# EasyEDA schematic SCH_CyGarageM2.json
TITLE: CyGarage Model 2 (Dual Door); REV: 1.2; Date: 2022-08-23; Sheet: 1/1; Drawn By: Cyrus Brunner; Company: CyrusBuilt
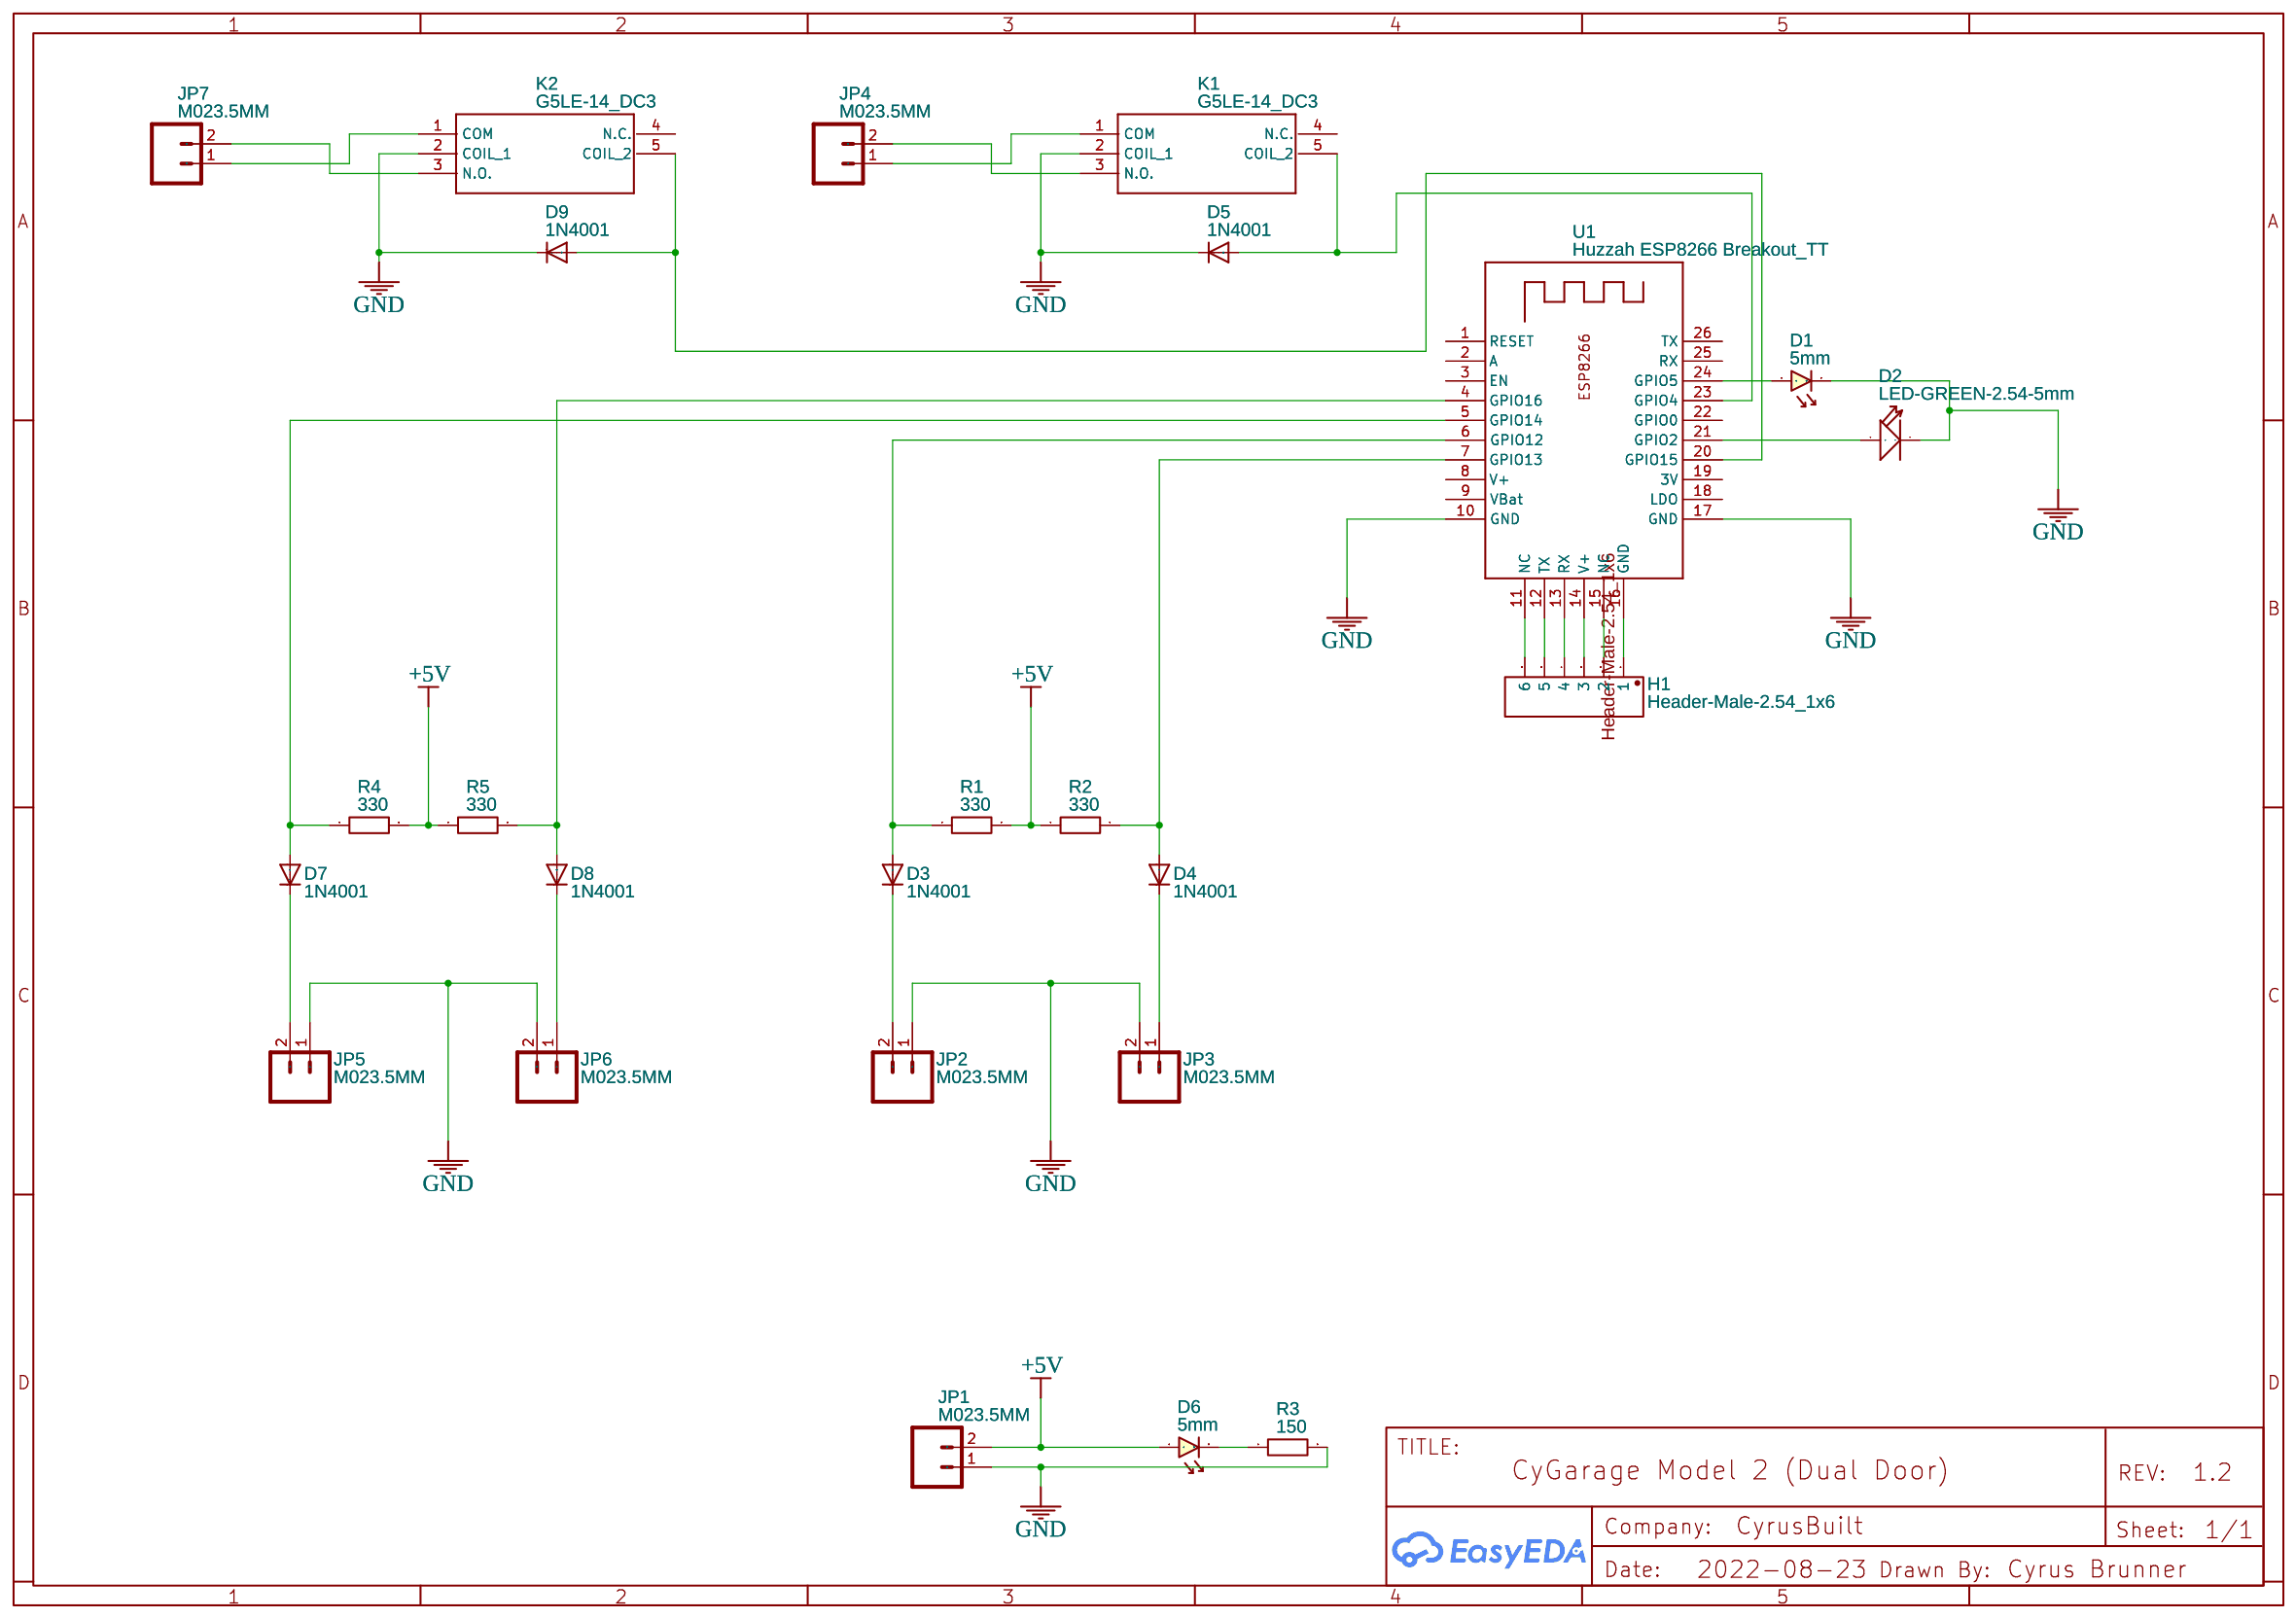
[diagram p0: schematic sheet]

## Parts
D1  5mm  [PKG-LED-5MM-RED]
D2  LED-GREEN-2.54-5mm  [LED-GREEN-2.54-5MM-YUN]
D3  1N4001  [DIODE-1N4001]
D4  1N4001  [DIODE-1N4001]
D5  1N4001  [DIODE-1N4001]
D6  5mm  [PKG-LED-5MM-RED]
D7  1N4001  [DIODE-1N4001]
D8  1N4001  [DIODE-1N4001]
D9  1N4001  [DIODE-1N4001]
H1  Header-Male-2.54_1x6  [HEADER-MALE-2.54_1X6]
JP1  M023.5MM  [SCREWTERMINAL-3.5MM-2]
JP2  M023.5MM  [SCREWTERMINAL-3.5MM-2]
JP3  M023.5MM  [SCREWTERMINAL-3.5MM-2]
JP4  M023.5MM  [SCREWTERMINAL-3.5MM-2]
JP5  M023.5MM  [SCREWTERMINAL-3.5MM-2]
JP6  M023.5MM  [SCREWTERMINAL-3.5MM-2]
JP7  M023.5MM  [SCREWTERMINAL-3.5MM-2]
K1  G5LE-14_DC3  [G5LE-14_SPDT]
K2  G5LE-14_DC3  [G5LE-14_SPDT]
R1  330  [RESISTOR 1/4 WATT 330 OHM]
R2  330  [RESISTOR 1/4 WATT 330 OHM]
R3  150  [RESISTOR 1/4 WATT 150 OHM]
R4  330  [RESISTOR 1/4 WATT 330 OHM]
R5  330  [RESISTOR 1/4 WATT 330 OHM]
U1  Huzzah ESP8266 Breakout_TT  [HUZZAH 8266]

## Library data of the parts
D1 D6 = L-1503EC: Color: Red; WaveLength: 617nm; Forward Voltage: 2.0V; Manufacturer: KINGBRIGHT; Supplier Part: 1003201; Supplier: Element14; link: http://www.farnell.com/datasheets/2046493.pdf?_ga=2.91228057.244688081.1505921947-238689616.1505921947&_gac=1.213042848.1505921947.EAIaIQobChMIsdP1s4y01gIVhxwbCh2_CAopEAAYASAAEgKnhPD_BwE; Contributor: Prof. Ing. F. Scordino
D2 = LED-GREEN-2.54-5mm: DIP LED Transparent-Orange;; Manufacturer Part: 503UOC; Contributor: koreawide
D3-D5 D7-D9 = 1N4001: Contributor: SparkFun
H1 = Header-Male-2.54_1x6: Contributor: RexBoy
JP1-JP7 = M023.5MM: Standard 2-pin 0.1 header. Use with; Contributor: SparkFun
K1 K2 = G5LE-14_DC3: Contributor: Diego Perello
R1 R2 R4 R5 = 330: Contributor: Hendriyana
R3 = 150: Contributor: Hendriyana
U1 = Huzzah ESP8266 Breakout_TT: Manufacturer: Adafruit; link: https://www.adafruit.com/product/2471; Contributor: t_thompson92

## Nets
+5V: D6.1 JP1.2 R1.2 R2.1 R4.2 R5.1
GND: D1.2 D2.- D5.C D9.C JP1.1 JP2.1 JP3.2 JP5.1 JP6.2 K1.2(COIL_1) K2.2(COIL_1) R3.2 U1.10(GND) U1.17(GND)
Net-(D1-1): D1.1 U1.24(GPIO5)
Net-(D2-+): D2.+ U1.21(GPIO2)
Net-(D3-A): D3.A R1.1 U1.6(GPIO12)
Net-(D3-C): D3.C JP2.2
Net-(D4-A): D4.A R2.2 U1.7(GPIO13)
Net-(D4-C): D4.C JP3.1
Net-(D5-A): D5.A K1.5(COIL_2) U1.23(GPIO4)
Net-(D6-2): D6.2 R3.1
Net-(D7-A): D7.A R4.1 U1.5(GPIO14)
Net-(D7-C): D7.C JP5.2
Net-(D8-A): D8.A R5.2 U1.4(GPIO16)
Net-(D8-C): D8.C JP6.1
Net-(D9-A): D9.A K2.5(COIL_2) U1.20(GPIO15)
Net-(H1-1): H1.1 U1.16(GND)
Net-(H1-2): H1.2 U1.15(NC)
Net-(H1-3): H1.3 U1.14(V+)
Net-(H1-4): H1.4 U1.13(RX)
Net-(H1-5): H1.5 U1.12(TX)
Net-(H1-6): H1.6 U1.11(NC)
Net-(JP4-1): JP4.1 K1.1(COM)
Net-(JP4-2): JP4.2 K1.3(N.O.)
Net-(JP7-1): JP7.1 K2.1(COM)
Net-(JP7-2): JP7.2 K2.3(N.O.)

Not connected (* = marked no-connect by the designer): K1 4(N.C.); K2 4(N.C.); U1 1(RESET) 2(A) 3(EN) 8(V+) 9(VBat) 18(LDO) 19(3V) 22(GPIO0) 25(RX) 26(TX)
